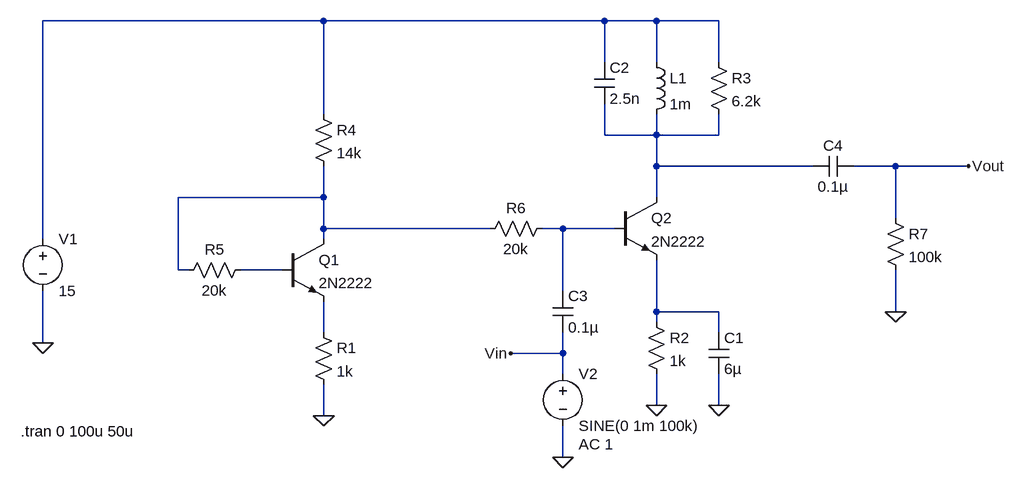
[diagram p0: schematic Draft1.asc]
Draft1.asc, the LTspice schematic file:
Version 4
SHEET 1 1160 680
WIRE 96 -208 -336 -208
WIRE 528 -208 96 -208
WIRE 608 -208 528 -208
WIRE 704 -208 608 -208
WIRE 528 -144 528 -208
WIRE 608 -144 608 -208
WIRE 704 -144 704 -208
WIRE 96 -64 96 -208
WIRE 528 -32 528 -80
WIRE 608 -32 608 -64
WIRE 608 -32 528 -32
WIRE 704 -32 704 -64
WIRE 704 -32 608 -32
WIRE 608 16 608 -32
WIRE 848 16 608 16
WIRE 976 16 912 16
WIRE 1088 16 976 16
WIRE 96 64 96 16
WIRE 96 64 -128 64
WIRE 608 64 608 16
WIRE 976 96 976 16
WIRE 96 112 96 64
WIRE 352 112 96 112
WIRE 464 112 432 112
WIRE 544 112 464 112
WIRE -336 128 -336 -208
WIRE 96 128 96 112
WIRE -128 176 -128 64
WIRE -112 176 -128 176
WIRE 32 176 -32 176
WIRE 464 208 464 112
WIRE 608 240 608 160
WIRE 704 240 608 240
WIRE 976 240 976 176
WIRE 608 256 608 240
WIRE 96 272 96 224
WIRE 704 272 704 240
WIRE -336 288 -336 208
WIRE 464 304 464 272
WIRE 464 304 384 304
WIRE 464 336 464 304
WIRE 608 384 608 336
WIRE 704 384 704 336
WIRE 96 400 96 352
WIRE 464 464 464 416
FLAG 96 400 0
FLAG 608 384 0
FLAG 704 384 0
FLAG -336 288 0
FLAG 464 464 0
FLAG 976 240 0
FLAG 1088 16 Vout
FLAG 384 304 Vin
SYMBOL npn 32 128 R0
SYMATTR InstName Q1
SYMATTR Value 2N2222
SYMBOL npn 544 64 R0
SYMATTR InstName Q2
SYMATTR Value 2N2222
SYMBOL res 80 256 R0
SYMATTR InstName R1
SYMATTR Value 1k
SYMBOL res 592 240 R0
SYMATTR InstName R2
SYMATTR Value 1k
SYMBOL cap 688 272 R0
SYMATTR InstName C1
SYMATTR Value 6µ
SYMBOL ind 592 -160 R0
SYMATTR InstName L1
SYMATTR Value 1m
SYMBOL cap 512 -144 R0
SYMATTR InstName C2
SYMATTR Value 2.5n
SYMBOL res 688 -160 R0
SYMATTR InstName R3
SYMATTR Value 6.2k
SYMBOL res 80 -80 R0
SYMATTR InstName R4
SYMATTR Value 14k
SYMBOL res -16 160 R90
WINDOW 0 0 56 VBottom 2
WINDOW 3 32 56 VTop 2
SYMATTR InstName R5
SYMATTR Value 20k
SYMBOL res 448 96 R90
WINDOW 0 0 56 VBottom 2
WINDOW 3 32 56 VTop 2
SYMATTR InstName R6
SYMATTR Value 20k
SYMBOL voltage -336 112 R0
SYMATTR InstName V1
SYMATTR Value 15
SYMBOL cap 448 208 R0
SYMATTR InstName C3
SYMATTR Value 0.1µ
SYMBOL voltage 464 320 R0
WINDOW 123 24 124 Left 2
WINDOW 39 0 0 Left 0
SYMATTR InstName V2
SYMATTR Value SINE(0 1m 100k)
SYMATTR Value2 AC 1
SYMBOL cap 912 0 R90
WINDOW 0 0 32 VBottom 2
WINDOW 3 32 32 VTop 2
SYMATTR InstName C4
SYMATTR Value 0.1µ
SYMBOL res 960 80 R0
SYMATTR InstName R7
SYMATTR Value 100k
TEXT -370 424 Left 2 !.tran 0 100u 50u

The netlist it stands for:
* Draft1.asc
Q1 N003 N005 N007 0 2N2222
Q2 N002 N004 N006 0 2N2222
R1 N007 0 1k
R2 N006 0 1k
C1 N006 0 6µ
L1 N001 N002 1m
C2 N001 N002 2.5n
R3 N001 N002 6.2k
R4 N001 N003 14k
R5 N005 N003 20k
R6 N004 N003 20k
V1 N001 0 15
C3 N004 Vin 0.1µ
V2 Vin 0 SINE(0 1m 100k) AC 1
C4 Vout N002 0.1µ
R7 Vout 0 100k
.model NPN NPN
.model PNP PNP
.lib standard.bjt
.tran 0 100u 50u
.backanno
.end